# Altium schematic sheet MotorDriveBoard.SchDoc
size A4; SheetNumber: 2; SheetTotal: 7
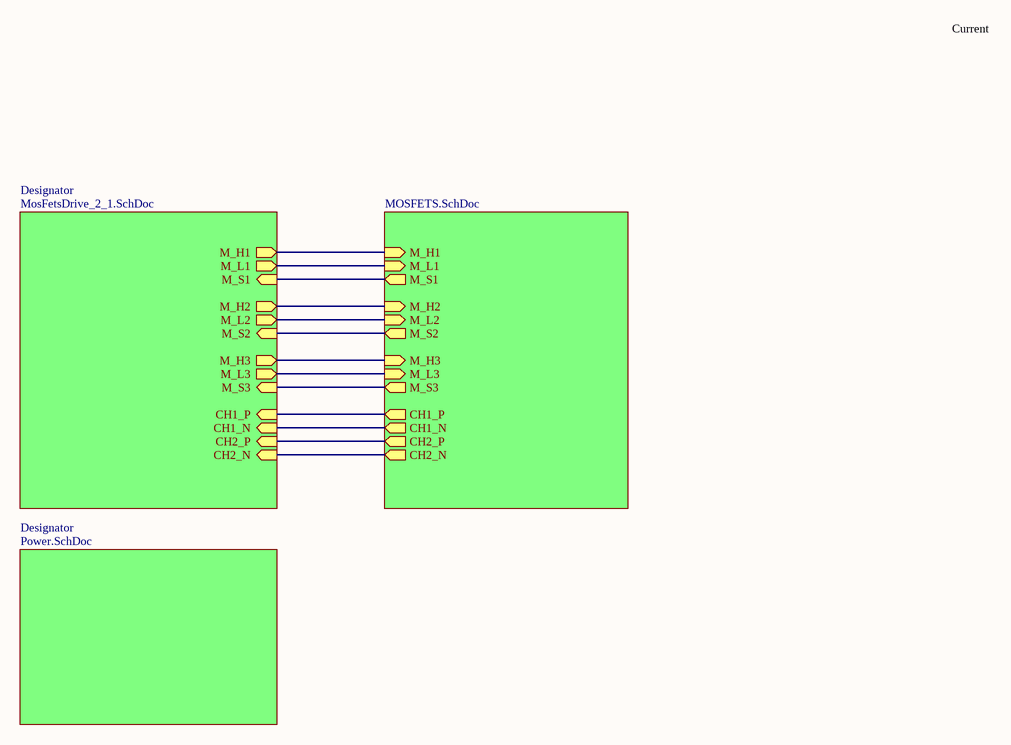
[diagram p0: MotorDriveBoard.SchDoc]

## Sub-sheets
Designator = MosFetsDrive_2_1.SchDoc: M_H1 (out), M_L1 (out), M_H2 (out), M_L2 (out), M_H3 (out), M_L3 (out), M_S1 (in), M_S2 (in), M_S3 (in), CH1_P (in), CH1_N (in), CH2_P (in), CH2_N (in)
Designator = Power.SchDoc: no entries
? = MOSFETS.SchDoc: M_H1 (in), M_L1 (in), M_H2 (in), M_L2 (in), M_H3 (in), M_L3 (in), M_S1 (out), M_S2 (out), M_S3 (out), CH1_P (out), CH1_N (out), CH2_P (out), CH2_N (out)

## Nets
(unnamed): sheet /M_H1, sheet Designator/M_H1
(unnamed): sheet /M_L1, sheet Designator/M_L1
(unnamed): sheet /M_H2, sheet Designator/M_H2
(unnamed): sheet /M_L2, sheet Designator/M_L2
(unnamed): sheet /M_H3, sheet Designator/M_H3
(unnamed): sheet /M_L3, sheet Designator/M_L3
(unnamed): sheet /M_S1, sheet Designator/M_S1
(unnamed): sheet /M_S2, sheet Designator/M_S2
(unnamed): sheet /M_S3, sheet Designator/M_S3
(unnamed): sheet /CH1_P, sheet Designator/CH1_P
(unnamed): sheet /CH1_N, sheet Designator/CH1_N
(unnamed): sheet /CH2_P, sheet Designator/CH2_P
(unnamed): sheet /CH2_N, sheet Designator/CH2_N

## Notes on the sheet
- Current